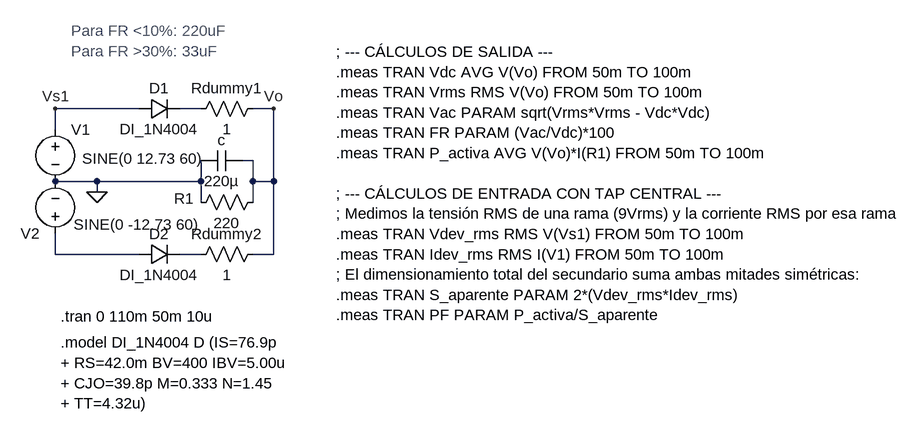
[diagram p0: schematic OndaCompleta RC.asc]
OndaCompleta RC.asc, the LTspice schematic file:
Version 4.1
SHEET 1 1396 680
WIRE 160 112 32 112
WIRE 256 112 224 112
WIRE 368 112 336 112
WIRE 32 144 32 112
WIRE 336 192 320 192
WIRE 96 224 32 224
WIRE 256 224 256 192
WIRE 256 224 96 224
WIRE 336 224 336 192
WIRE 368 224 368 112
WIRE 368 224 336 224
WIRE 96 240 96 224
WIRE 256 256 256 224
WIRE 336 256 336 224
WIRE 32 336 32 304
WIRE 160 336 32 336
WIRE 256 336 224 336
WIRE 368 336 368 224
WIRE 368 336 336 336
FLAG 96 240 0
FLAG 368 112 Vo
FLAG 32 112 Vs1
SYMBOL voltage 32 128 R0
WINDOW 123 0 0 Left 0
WINDOW 39 0 0 Left 0
WINDOW 3 41 61 Left 2
SYMATTR Value SINE(0 12.73 60)
SYMATTR InstName V1
SYMBOL res 352 96 R90
WINDOW 0 0 56 VBottom 2
WINDOW 3 32 56 VTop 2
SYMATTR InstName Rdummy1
SYMATTR Value 1
SYMBOL diode 160 128 R270
WINDOW 0 32 32 VTop 2
WINDOW 3 0 32 VBottom 2
SYMATTR InstName D1
SYMATTR Value DI_1N4004
SYMBOL voltage 32 320 R180
WINDOW 123 0 0 Left 0
WINDOW 39 0 0 Left 0
WINDOW 3 -223 30 Left 2
SYMATTR Value SINE(0 -12.73 60)
SYMATTR InstName V2
SYMBOL res 352 240 R90
WINDOW 0 26 122 VBottom 2
WINDOW 3 32 56 VTop 2
SYMATTR InstName R1
SYMATTR Value 220
SYMBOL res 352 320 R90
WINDOW 0 0 56 VBottom 2
WINDOW 3 32 56 VTop 2
SYMATTR InstName Rdummy2
SYMATTR Value 1
SYMBOL diode 160 352 R270
WINDOW 0 32 32 VTop 2
WINDOW 3 0 32 VBottom 2
SYMATTR InstName D2
SYMATTR Value DI_1N4004
SYMBOL cap 320 176 R90
WINDOW 0 0 32 VBottom 2
WINDOW 3 32 32 VTop 2
SYMATTR InstName c
SYMATTR Value 220µ
TEXT 40 432 Left 2 !.tran 0 110m 50m 10u
TEXT 40 472 Left 2 !.model DI_1N4004 D (IS=76.9p \n+ RS=42.0m BV=400 IBV=5.00u \n+ CJO=39.8p M=0.333 N=1.45 \n+ TT=4.32u)
TEXT 56 -8 Left 2 ;Para FR <10%: 220uF\nPara FR >30%: 33uF
TEXT 464 24 Left 2 !; --- CÁLCULOS DE SALIDA ---\n.meas TRAN Vdc AVG V(Vo) FROM 50m TO 100m\n.meas TRAN Vrms RMS V(Vo) FROM 50m TO 100m\n.meas TRAN Vac PARAM sqrt(Vrms*Vrms - Vdc*Vdc)\n.meas TRAN FR PARAM (Vac/Vdc)*100\n.meas TRAN P_activa AVG V(Vo)*I(R1) FROM 50m TO 100m\n \n; --- CÁLCULOS DE ENTRADA CON TAP CENTRAL ---\n; Medimos la tensión RMS de una rama (9Vrms) y la corriente RMS por esa rama\n.meas TRAN Vdev_rms RMS V(Vs1) FROM 50m TO 100m\n.meas TRAN Idev_rms RMS I(V1) FROM 50m TO 100m\n; El dimensionamiento total del secundario suma ambas mitades simétricas:\n.meas TRAN S_aparente PARAM 2*(Vdev_rms*Idev_rms)\n.meas TRAN PF PARAM P_activa/S_aparente

The netlist it stands for:
* OndaCompleta RC.asc
V1 Vs1 0 SINE(0 12.73 60)
Rdummy1 Vo N001 1
D1 Vs1 N001 DI_1N4004
V2 N002 0 SINE(0 -12.73 60)
R1 Vo 0 220
Rdummy2 Vo N003 1
D2 N002 N003 DI_1N4004
c Vo 0 220µ
.model D D
.lib standard.dio
.tran 0 110m 50m 10u
.model DI_1N4004 D (IS=76.9p
+ RS=42.0m BV=400 IBV=5.00u
+ CJO=39.8p M=0.333 N=1.45
+ TT=4.32u)
* Para FR <10%: 220uF
* Para FR >30%: 33uF
; --- CÁLCULOS DE SALIDA ---
.meas TRAN Vdc AVG V(Vo) FROM 50m TO 100m
.meas TRAN Vrms RMS V(Vo) FROM 50m TO 100m
.meas TRAN Vac PARAM sqrt(Vrms*Vrms - Vdc*Vdc)
.meas TRAN FR PARAM (Vac/Vdc)*100
.meas TRAN P_activa AVG V(Vo)*I(R1) FROM 50m TO 100m
; --- CÁLCULOS DE ENTRADA CON TAP CENTRAL ---
; Medimos la tensión RMS de una rama (9Vrms) y la corriente RMS por esa rama
.meas TRAN Vdev_rms RMS V(Vs1) FROM 50m TO 100m
.meas TRAN Idev_rms RMS I(V1) FROM 50m TO 100m
; El dimensionamiento total del secundario suma ambas mitades simétricas:
.meas TRAN S_aparente PARAM 2*(Vdev_rms*Idev_rms)
.meas TRAN PF PARAM P_activa/S_aparente
.backanno
.end